# Altium schematic sheet I2C.SchDoc
size A4; SheetNumber: 2; SheetTotal: 7
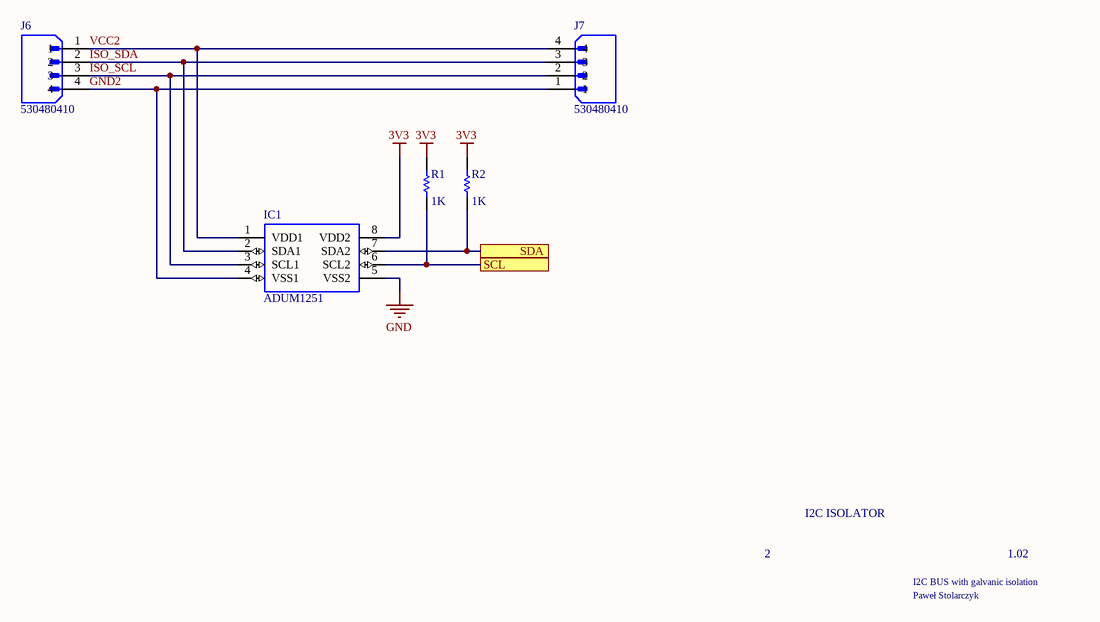
[diagram p0: I2C.SchDoc]

## Parts
IC1  ADUM1251  [SOIC127P600X175-8N]
J6  530480410  [MOLEX_530480410]
J7  530480410  [MOLEX_530480410]
R1  value 1K  [0402]  (hidden comment: Res1)
R2  value 1K  [0402]  (hidden comment: Res1)

## Ports
SCL (see BMS_SLAVE[2B], MCU[1B]), SDA (see BMS_SLAVE[2B], MCU[1B])

## Nets
3V3: IC1.8(VDD2) R1.2 R2.2
GND: IC1.5(VSS2)
GND2: IC1.4(VSS1) J6.4 J7.1
ISO_SCL: IC1.3(SCL1) J6.3 J7.2
ISO_SDA: IC1.2(SDA1) J6.2 J7.3
SCL: IC1.6(SCL2) R1.1 ; port SCL
SDA: IC1.7(SDA2) R2.1 ; port SDA
VCC2: IC1.1(VDD1) J6.1 J7.4

## Notes on the sheet
- I2C ISOLATOR
- 2
- I2C BUS with galvanic isolation
- 1.02
- Paweł Stolarczyk

## Library data of the parts
IC1 = ADUM1251: IÂ²C Digital Isolator 2500Vrms 2 Channel 1Mbps 25kV/Âµs CMTI 8-SOIC (0.154, 3.90mm Width); MF: Analog Devices; Package: SOIC-8 Analog Devices; MP: ADUM1251; Value: *; Price: None; SnapEDA_Link: https://www.snapeda.com/parts/ADUM1251/Analog%20Devices%20Inc./view-part/3223540/?ref=snap; Availability: Unavailable
R1 R2 = Res1: Resistor; Published: 8-Jun-2000; LatestRevisionDate: 17-Jul-2002; LatestRevisionNote: Re-released for DXP Platform.; PackageReference: AXIAL-0.3; Publisher: Altium Limited; PackageDescription: Axial Device, Thru-Hole; 2 Leads; 0.3 in Pin Spacing
J6 J7 = 530480410: Availability: Unavailable; Price: None; Package: None; Value: *; MP: 530480410